# EAGLE design untitled2-6-2 (EAGLE 9.6.2)
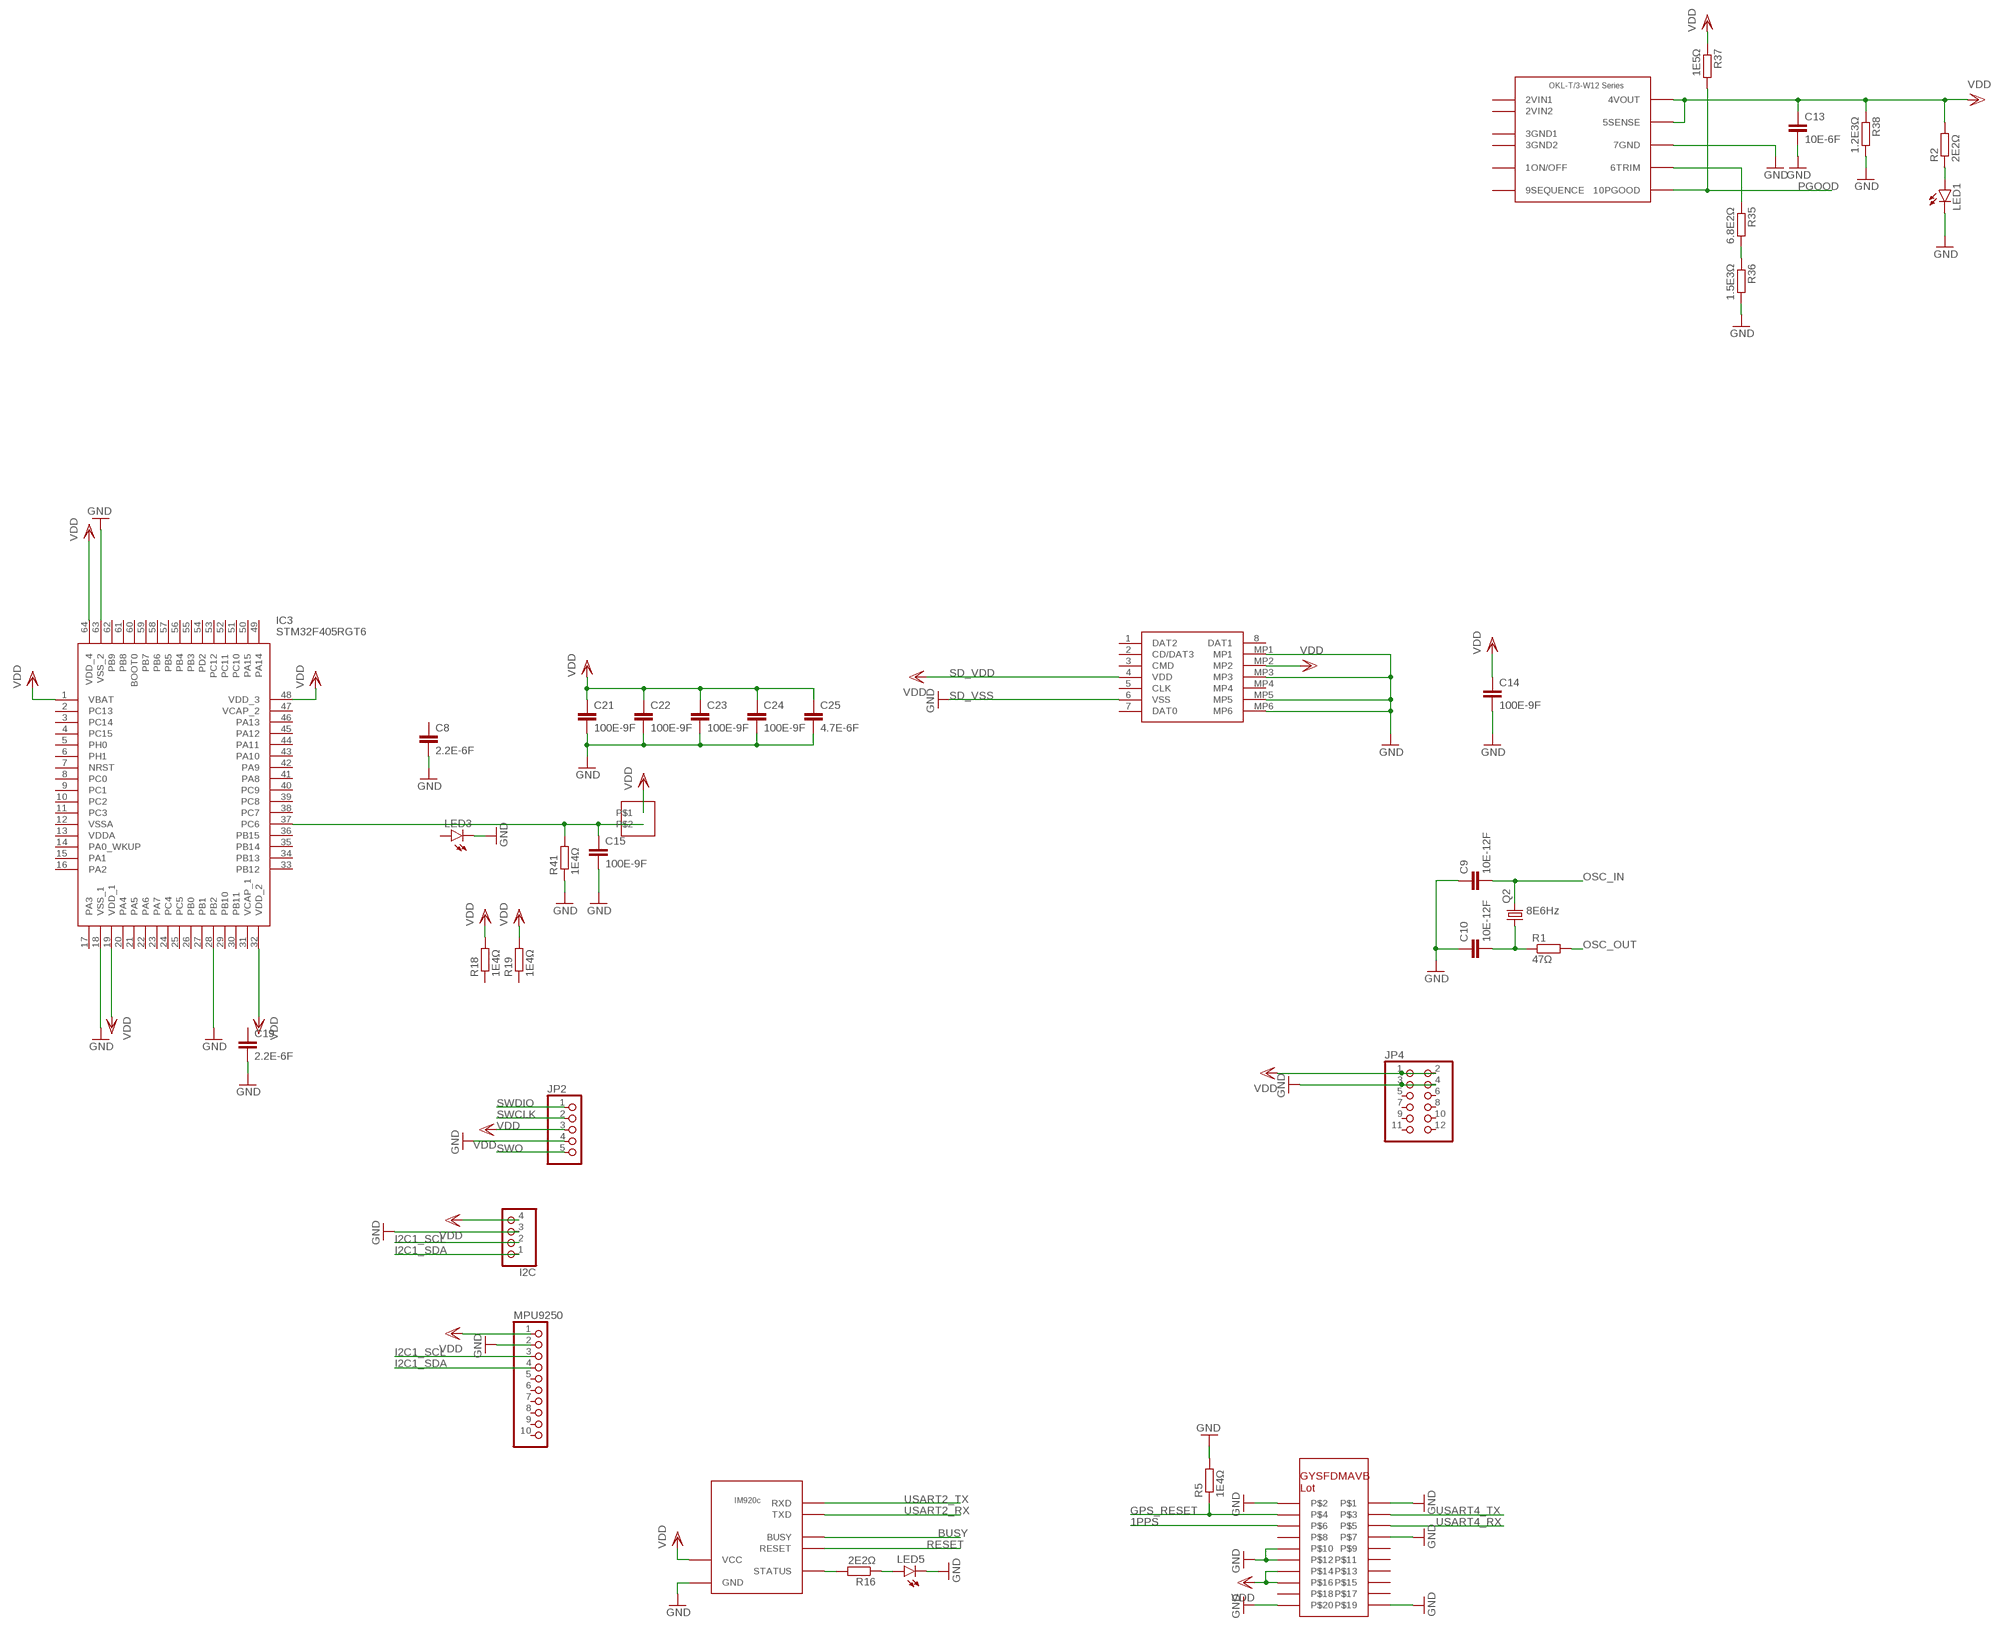
[diagram p0: schematic, sheet 1]

## Parts
C8  2.2E-6F  C-EUC0805  [C0805]
C9  10E-12F  C-EUC0805  [C0805]
C10  10E-12F  C-EUC0805  [C0805]
C13  10E-6F  C-EUC0805  [C0805]
C14  100E-9F  C-EUC0805  [C0805]
C15  100E-9F  C-EUC0805  [C0805]
C19  2.2E-6F  C-EUC0805  [C0805]
C21  100E-9F  C-EUC0805  [C0805]
C22  100E-9F  C-EUC0805  [C0805]
C23  100E-9F  C-EUC0805  [C0805]
C24  100E-9F  C-EUC0805  [C0805]
C25  4.7E-6F  C-EUC0805  [C0805]
I2C  PINHD-1X4  [1X04]
IC3  STM32F405RGT6  [QFP50P1200X1200X160-64N]
J1  DM3AT-SF-PEJM5  [DM3ATSFPEJM5]
JP2  PINHD-1X5  [1X05]
JP4  PINHD-2X6  [2X06]
LED1  LEDCHIP-LED0805  [CHIP-LED0805]
LED3  LEDCHIP-LED0805  [CHIP-LED0805]
LED5  LEDCHIP-LED0805  [CHIP-LED0805]
MPU9250  PINHD-1X10  [1X10]
Q2  CRYSTALCTS406  [CTS406]
R1  47Ω  R-EU_R0603  [R0603]
R2  2E2Ω  R-EU_R0603  [R0603]
R5  1E4Ω  R-EU_R0603  [R0603]
R16  2E2Ω  R-EU_R0603  [R0603]
R18  1E4Ω  R-EU_R0603  [R0603]
R19  1E4Ω  R-EU_R0603  [R0603]
R35  6.8E2Ω  R-EU_R0603  [R0603]
R36  1.5E3Ω  R-EU_R0603  [R0603]
R37  1E5Ω  R-EU_R0603  [R0603]
R38  1.2E3Ω  R-EU_R0603  [R0603]
R41  1E4Ω  R-EU_R0603  [R0603]
U$3  OKL-T/3-W12SERIES  [OKL-T/3-W12SERIES]
U$4  GYSFDMAXB_LOT  [GYSFDMAXB_LOT]
U$5  IM920C  [IM920C]
U$10  B2B-XH-A  [B2B-XH-A]

## Nets
1PPS: U$4.P$6
BUSY: U$5.BUSY
GND [VCC]: C8.2 C9.1 C10.1 C13.2 C14.2 C15.2 C19.2 C21.2 C22.2 C23.2 C24.2 C25.2 I2C.3 IC3.18(VSS_1) IC3.28(PB2) IC3.63(VSS_2) J1.6(VSS) J1.MP1 J1.MP3 J1.MP5 J1.MP6 JP2.4 JP4.3 JP4.4 LED1.C LED3.C LED5.C MPU9250.2 R5.2 R36.2 R38.2 R41.1 U$3.7GND U$4.P$1 U$4.P$2 U$4.P$7 U$4.P$10 U$4.P$12 U$4.P$19 U$4.P$20 U$5.GND
GPS_RESET: R5.1 U$4.P$4
I2C1_SCL: I2C.2 MPU9250.3
I2C1_SDA: I2C.1 MPU9250.4
N$1: R16.2 U$5.STATUS
N$2: LED1.A R2.1
N$5 [VCC]: C15.1 IC3.37(PC6) R41.2 U$10.P$2
N$7: C10.2 Q2.1 R1.1
N$27: R35.1 U$3.6TRIM
N$31: R35.2 R36.1
N$36: LED5.A R16.1
OSC_IN: C9.2 Q2.3
OSC_OUT: R1.2
PGOOD: R37.2 U$3.10PGOOD
RESET: U$5.RESET
SWCLK: JP2.2
SWDIO: JP2.1
SWO: JP2.5
USART2_RX: U$5.TXD
USART2_TX: U$5.RXD
USART4_RX: U$4.P$5
USART4_TX: U$4.P$3
VDD [VDD]: C13.1 C14.1 C21.1 C22.1 C23.1 C24.1 C25.1 I2C.4 IC3.1(VBAT) IC3.19(VDD_1) IC3.32(VDD_2) IC3.48(VDD_3) IC3.64(VDD_4) J1.4(VDD) J1.MP2 JP2.3 JP4.1 JP4.2 MPU9250.1 R2.2 R18.2 R19.2 R37.1 R38.1 U$3.4VOUT U$3.5SENSE U$4.P$14 U$4.P$16 U$5.VCC U$10.P$1
Unconnected: C8.1 C19.1 IC3.2(PC13) IC3.3(PC14) IC3.4(PC15) IC3.5(PH0) IC3.6(PH1) IC3.7(NRST) IC3.8(PC0) IC3.9(PC1) IC3.10(PC2) IC3.11(PC3) IC3.12(VSSA) IC3.13(VDDA) IC3.14(PA0_WKUP) IC3.15(PA1) IC3.16(PA2) IC3.17(PA3) IC3.20(PA4) IC3.21(PA5) IC3.22(PA6) IC3.23(PA7) IC3.24(PC4) IC3.25(PC5) IC3.26(PB0) IC3.27(PB1) IC3.29(PB10) IC3.30(PB11) IC3.31(VCAP_1) IC3.33(PB12) IC3.34(PB13) IC3.35(PB14) IC3.36(PB15) IC3.38(PC7) IC3.39(PC8) IC3.40(PC9) IC3.41(PA8) IC3.42(PA9) IC3.43(PA10) IC3.44(PA11) IC3.45(PA12) IC3.46(PA13) IC3.47(VCAP_2) IC3.49(PA14) IC3.50(PA15) IC3.51(PC10) IC3.52(PC11) IC3.53(PC12) IC3.54(PD2) IC3.55(PB3) IC3.56(PB4) IC3.57(PB5) IC3.58(PB6) IC3.59(PB7) IC3.60(BOOT0) IC3.61(PB8) IC3.62(PB9) J1.1(DAT2) J1.2(CD/DAT3) J1.3(CMD) J1.5(CLK) J1.7(DAT0) J1.8(DAT1) J1.MP4 JP4.5 JP4.6 JP4.7 JP4.8 JP4.9 JP4.10 JP4.11 JP4.12 LED3.A MPU9250.5 MPU9250.6 MPU9250.7 MPU9250.8 MPU9250.9 MPU9250.10 R18.1 R19.1 U$3.1ON/OFF U$3.2VIN1 U$3.2VIN2 U$3.3GND1 U$3.3TGND2(3GND2) U$3.9SEQUENCE U$4.P$8 U$4.P$9 U$4.P$11 U$4.P$13 U$4.P$15 U$4.P$17 U$4.P$18

## Notes on the sheet
- SD_VDD
- SD_VSS
- 8E6Hz

## Library data of the parts
C8-C10 C13-C15 C19 C21-C25 = rcl:C-EU: CAPACITOR, European symbol; SPICEPREFIX: C
I2C = pinhead:PINHD-1X4: PIN HEADER
IC3 = SamacSys_Parts:STM32F405RGT6: MCU 32-Bit, ARM Cortex M4, 1MB Flash STMicroelectronics STM32F405RGT6, 32bit ARM Cortex M4F Microcontroller, 168MHz, 1024 kB Flash, 64-Pin LQFP Source: Datasheet <http://www.st.com/web/en/resource/technical/document/datasheet/DM00037051.pdf>; DESCRIPTION: MCU 32-Bit, ARM Cortex M4, 1MB Flash STMicroelectronics STM32F405RGT6, 32bit ARM Cortex M4F Microcontroller, 168MHz, 1024 kB Flash, 64-Pin LQFP; HEIGHT: 1.6mm; MANUFACTURER_NAME: STMicroelectronics; MANUFACTURER_PART_NUMBER: STM32F405RGT6; MOUSER_PART_NUMBER: 511-STM32F405RGT6; MOUSER_PRICE-STOCK: https://www.mouser.co.uk/ProductDetail/STMicroelectronics/STM32F405RGT6?qs=Z8%252BeY1k3TIKgj7QWsYGpQw%3D%3D
J1 = SamacSys_Parts:DM3AT-SF-PEJM5: Memory Card Connectors R/A SMT MICROSD CON PUSH-PUSH TOP BRDMNT Source: Datasheet <https://datasheet.lcsc.com/szlcsc/Hirose-HRS-DM3AT-SF-PEJM5_C114218.pdf>; DESCRIPTION: Memory Card Connectors R/A SMT MICROSD CON PUSH-PUSH TOP BRDMNT; HEIGHT: 1.83mm; MANUFACTURER_NAME: Hirose; MANUFACTURER_PART_NUMBER: DM3AT-SF-PEJM5; MOUSER_PART_NUMBER: 798-DM3AT-SF-PEJM5; MOUSER_PRICE-STOCK: https://www.mouser.co.uk/ProductDetail/Hirose-Connector/DM3AT-SF-PEJM5/?qs=LZSZKJVF%252B2WTDKp%252BR7IYAQ%3D%3D
JP2 = pinhead:PINHD-1X5: PIN HEADER
JP4 = pinhead:PINHD-2X6: PIN HEADER
LED1 LED3 LED5 = led:LED: LED OSRAM: - CHIPLED LG R971, LG N971, LY N971, LG Q971, LY Q971, LO R971, LY R971 LH N974, LH R974 LS Q976, LO Q976, LY Q976 LO Q996 - Hyper CHIPLED LW Q18S LB Q993, LB Q99A, LB R99A - SideLED LS A670, LO A670, LY A670, LG A670, LP A670 LB A673, LV A673, LT A673, LW A673 LH A674 LY A675 LS A676, LA A676, LO A676, LY A676, LW A676 LS A679, LY A679, LG A679 - Hyper Micro SIDELED® LS Y876, LA Y876, LO Y876, LY Y876 LT Y87S - SmartLED LW L88C, LW L88S LB L89C, LB L89S, LG L890 LS L89K, LO L89K, LY L89K LS L896, LA L896, LO L896, LY L896 - TOPLED LS T670, LO T670, LY T670, LG T670, LP T670 LSG T670, LSP T670, LSY T670, LOP T670, LYG T670 LG T671, LOG T671, LSG T671 LB T673, LV T673, LT T673, LW T673 LH T674 LS T676, LA T676, LO T676, LY T676, LB T676, LH T676, LSB T676, LW T676 LB T67C, LV T67C, LT T67C, LS T67K, LO T67K, LY T67K, LW E67C LS E67B, LA E67B, LO E67B, LY E67B, LB E67C, LV E67C, LT E67C LW T67C LS T679, LY T679, LG T679 LS T770, LO T770, LY T770, LG T770, LP T770 LB T773, LV T773, LT T773, LW T773 LH T774 LS E675, LA E675, LY E675, LS T675 LS T776, LA T776, LO T776, LY T776, LB T776 LHGB T686 LT T68C, LB T68C - Hyper Mini TOPLED® LB M676 - Mini TOPLED Santana® LG M470 LS M47K, LO M47K, LY M47K Source: http://www.osram.convergy.de LUXEON: - LUMILED® LXK2-PW12-R00, LXK2-PW12-S00, LXK2-PW14-U00, LXK2-PW14-V00 LXK2-PM12-R00, LXK2-PM12-S00, LXK2-PM14-U00 LXK2-PE12-Q00, LXK2-PE12-R00, LXK2-PE12-S00, LXK2-PE14-T00, LXK2-PE14-U00 LXK2-PB12-K00, LXK2-PB12-L00, LXK2-PB12-M00, LXK2-PB14-N00, LXK2-PB14-P00, LXK2-PB14-Q00 LXK2-PR12-L00, LXK2-PR12-M00, LXK2-PR14-Q00, LXK2-PR14-R00 LXK2-PD12-Q00, LXK2-PD12-R00, LXK2-PD12-S00 LXK2-PH12-R00, LXK2-PH12-S00 LXK2-PL12-P00, LXK2-PL12-Q00, LXK2-PL12-R00 Source: www.luxeon.com KINGBRIGHT: KA-3528ASYC Source: www.kingbright.com
MPU9250 = pinhead:PINHD-1X10: PIN HEADER
Q2 = crystal:CRYSTAL: CRYSTAL; OC_FARNELL: unknown; OC_NEWARK: unknown
R1 R2 R5 R16 R18 R19 R35-R38 R41 = rcl:R-EU_: RESISTOR, European symbol; SPICEPREFIX: R
U$3 = untitled:OKL-T/3-W12SERIES
U$4 = untitled:GYSFDMAXB_LOT
U$5 = untitled:IM920C
U$10 = untitled:B2B-XH-A

## Net classes
1 supply: width 0.15 mm
2 VDD: width 0.254 mm
3 VCC: width 0.305 mm
4 VIN: width 0.61 mm

## Board
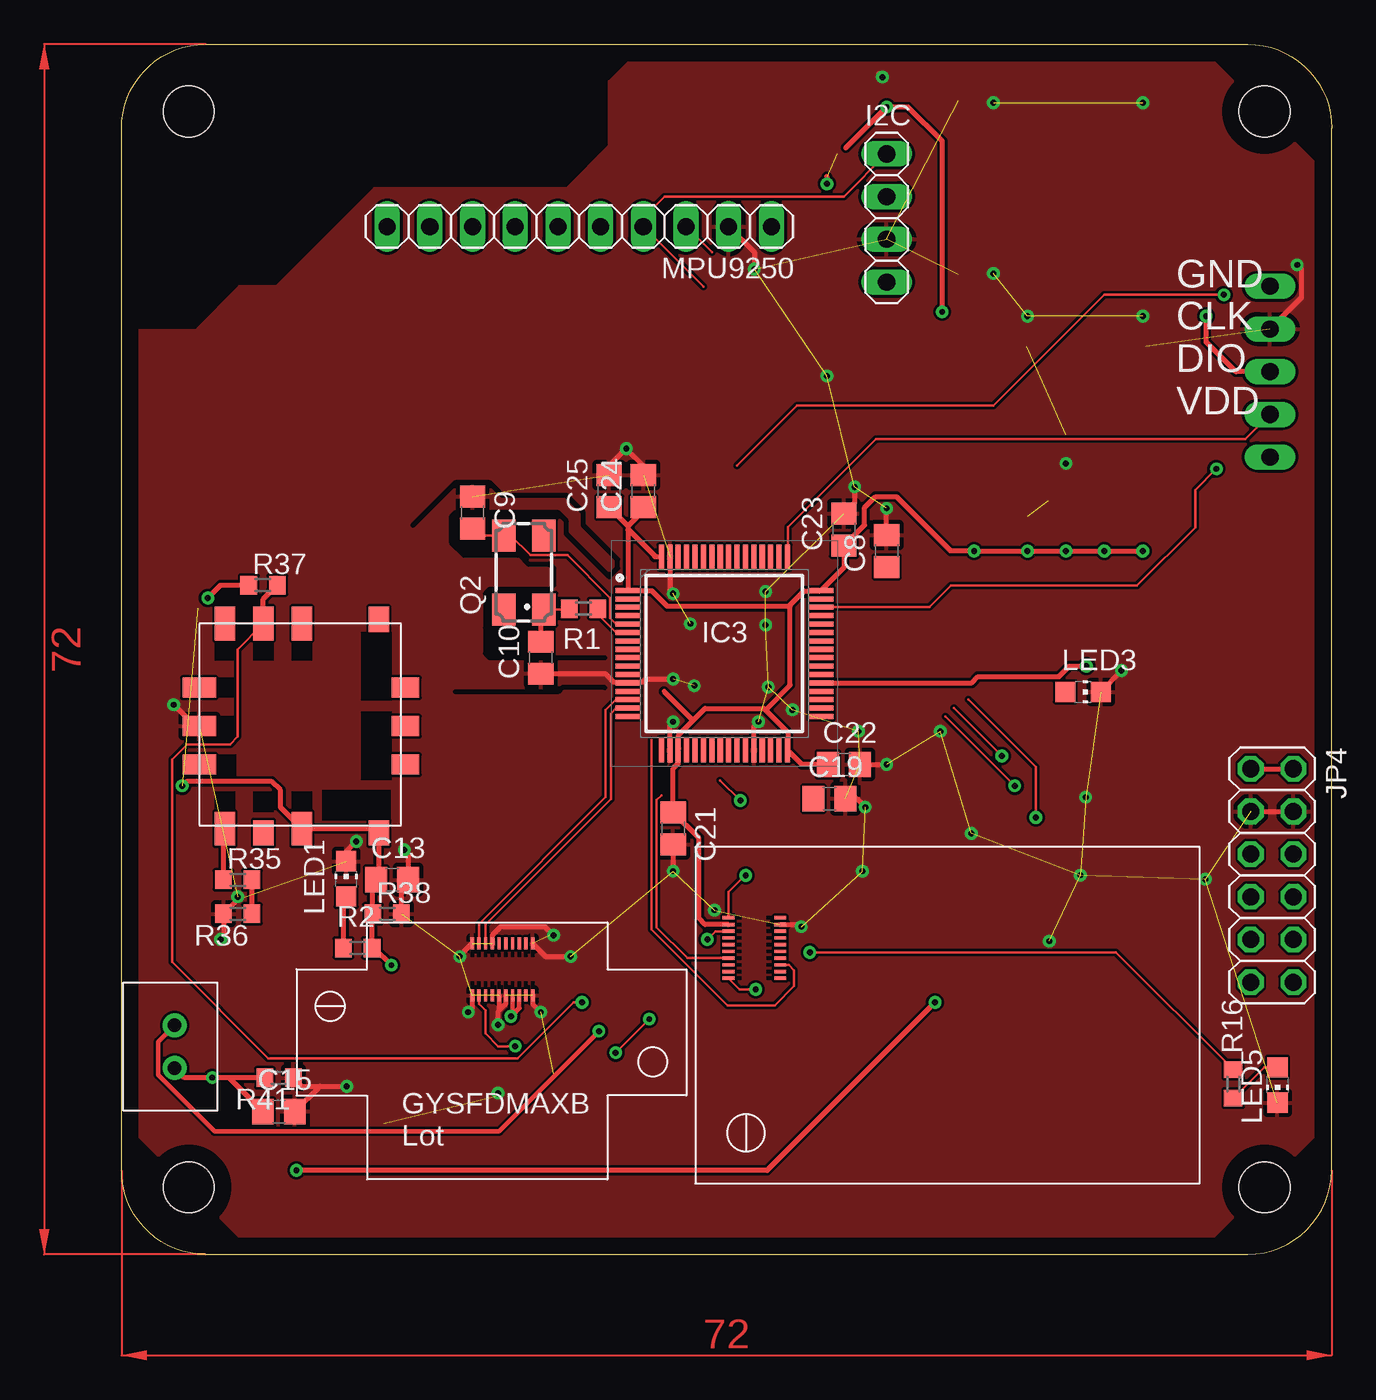
[diagram p1: board, top side]
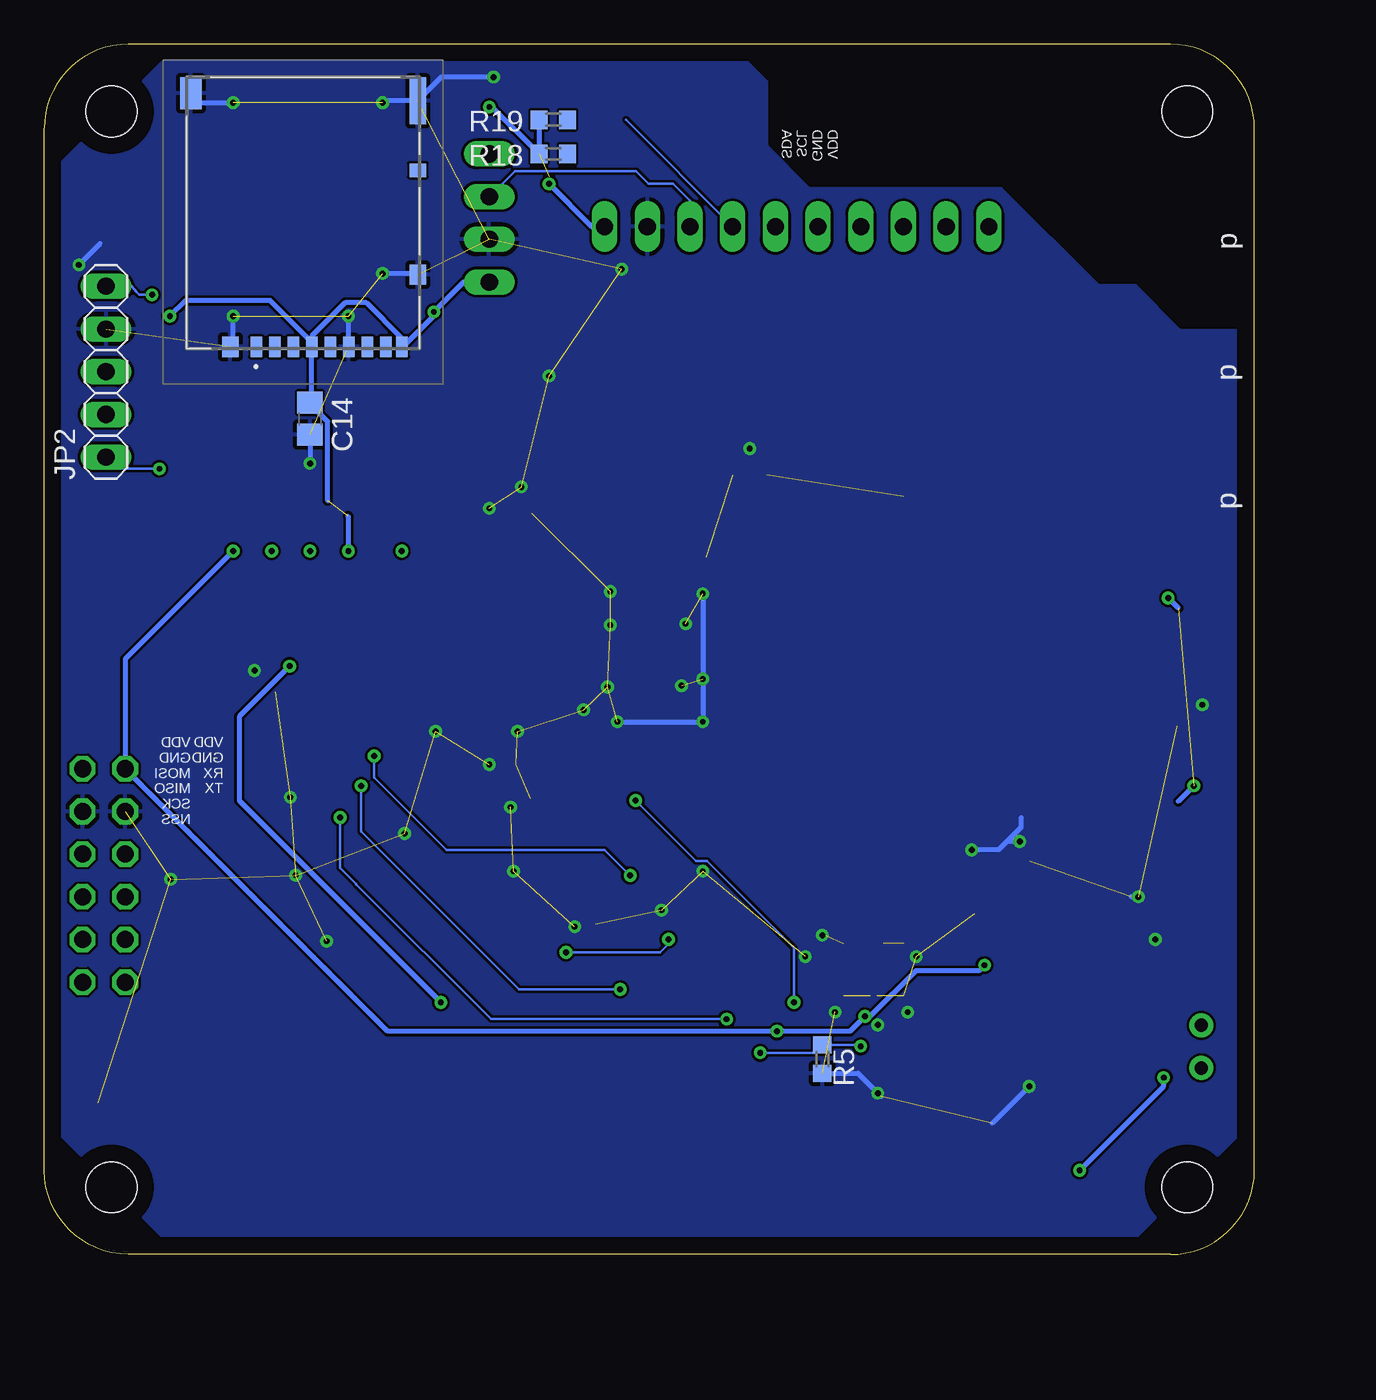
[diagram p2: board, bottom side, seen from below]

Size 72 x 72 mm. Coordinates in mm from the lower left corner, seen from the top.
Outline: 5,0 67,0 arc89 72,5 72,67 arc90 67,72 5,72 arc90 0,67 0,5 arc90 5,0
Copper layers (1*16): Top 0.035mm / dielectric 1.5mm / Bottom 0.035mm
Design rules "default": minimum track width 6mil, minimum drill 0.35mm, track to track 6mil, track to pad 6mil, pad to pad 6mil, via to via 6mil, smd to smd 6mil, copper to edge 40mil, drill to drill 6mil, minimum pad ring 10mil, minimum via ring 8mil, stop-mask expansion 4mil, vias tented up to drill 0mil, thermal gap 10mil
Holes 3 mm at 68,68 68,4 4,4 4,68
tRestrict: 36 lines

### Footprints (pad centres in the part's own frame; a part is rotated, then mirrored left to right if it is on the bottom)
C0805 = smd 1.3 x 1.5: 1 -0.95,0; 2 0.95,0
1X04 = drill 1.016 long: 1 -3.81,0; 2 -1.27,0; 3 1.27,0; 4 3.81,0
QFP50P1200X1200X160-64N = smd 1.475 x 0.3: 1 -5.738,3.75; 2 -5.738,3.25; 3 -5.738,2.75; 4 -5.738,2.25; 5 -5.738,1.75; 6 -5.738,1.25; 7 -5.738,0.75; 8 -5.738,0.25; 9 -5.738,-0.25; 10 -5.738,-0.75; 11 -5.738,-1.25; 12 -5.738,-1.75; 13 -5.738,-2.25; 14 -5.738,-2.75; 15 -5.738,-3.25; 16 -5.738,-3.75; 33 5.738,-3.75; 34 5.738,-3.25; 35 5.738,-2.75; 36 5.738,-2.25; 37 5.738,-1.75; 38 5.738,-1.25; 39 5.738,-0.75; 40 5.738,-0.25; 41 5.738,0.25; 42 5.738,0.75; 43 5.738,1.25; 44 5.738,1.75; 45 5.738,2.25; 46 5.738,2.75; 47 5.738,3.25; 48 5.738,3.75 | smd 0.3 x 1.475: 17 -3.75,-5.738; 18 -3.25,-5.738; 19 -2.75,-5.738; 20 -2.25,-5.738; 21 -1.75,-5.738; 22 -1.25,-5.738; 23 -0.75,-5.738; 24 -0.25,-5.738; 25 0.25,-5.738; 26 0.75,-5.738; 27 1.25,-5.738; 28 1.75,-5.738; 29 2.25,-5.738; 30 2.75,-5.738; 31 3.25,-5.738; 32 3.75,-5.738; 49 3.75,5.738; 50 3.25,5.738; 51 2.75,5.738; 52 2.25,5.738; 53 1.75,5.738; 54 1.25,5.738; 55 0.75,5.738; 56 0.25,5.738; 57 -0.25,5.738; 58 -0.75,5.738; 59 -1.25,5.738; 60 -1.75,5.738; 61 -2.25,5.738; 62 -2.75,5.738; 63 -3.25,5.738; 64 -3.75,5.738
DM3ATSFPEJM5 = smd 0.7 x 1.2: 1 2.775,7.412; 2 1.675,7.412; 3 0.575,7.412; 4 -0.525,7.412; 5 -1.625,7.412; 6 -2.725,7.412; 7 -3.825,7.412; 8 -4.925,7.412; MP2 -5.875,7.412 | smd 1 x 1.2: MP1 4.325,7.412; MP3 -6.825,3.112 | smd 1 x 0.8: MP4 -6.825,-3.087 | smd 1 x 2.8: MP5 -6.825,-7.237 | smd 1.3 x 1.9: MP6 6.675,-7.688
1X05 = drill 1.016 long: 1 -5.08,0; 2 -2.54,0; 3 0,0; 4 2.54,0; 5 5.08,0
2X06 = drill 1.016 octagon: 1 -6.35,-1.27; 2 -6.35,1.27; 3 -3.81,-1.27; 4 -3.81,1.27; 5 -1.27,-1.27; 6 -1.27,1.27; 7 1.27,-1.27; 8 1.27,1.27; 9 3.81,-1.27; 10 3.81,1.27; 11 6.35,-1.27; 12 6.35,1.27
CHIP-LED0805 = smd 1.2 x 1.2: A 0,-1.05; C 0,1.05
1X10 = drill 1.016 long: 1 -11.43,0; 2 -8.89,0; 3 -6.35,0; 4 -3.81,0; 5 -1.27,0; 6 1.27,0; 7 3.81,0; 8 6.35,0; 9 8.89,0; 10 11.43,0
CTS406 = smd 1.9 x 1.4: 1 -2.2,-1.2; 2 2.2,-1.2; 3 2.2,1.2; 4 -2.2,1.2
R0603 = smd 1 x 1.1: 1 -0.85,0; 2 0.85,0
OKL-T/3-W12SERIES = smd 2 x 1.2: 1ON/OFF 0,6.1; 5SENSE 12.2,6.1; 6TRIM 12.2,1.52; 9SEQUENCE 0,1.52; 10PGOOD 0,3.81 | smd 1.5 x 1.2: 2VIN1 -0.25,10.68; 4VOUT 12.45,10.68; P$10 12.45,3.81 | smd 1.2 x 1.63: 2VIN2 3.81,12.27; 3GND1 6.1,12.27; 3TGND2 8.39,12.27 | smd 1.2 x 2: 7GND 6.1,0; P$6 3.81,0; P$8 8.39,0
GYSFDMAXB_LOT = smd 0.2 x 0.7: P$1 -1.8,1.54; P$2 -1.8,-1.54; P$3 -1.4,1.54; P$4 -1.4,-1.54; P$5 -1,1.54; P$6 -1,-1.54; P$7 -0.6,1.54; P$8 -0.6,-1.54; P$9 -0.2,1.54; P$10 -0.2,-1.54; P$11 0.2,1.54; P$12 0.2,-1.54; P$13 0.6,1.54; P$14 0.6,-1.54; P$15 1,1.54; P$16 1,-1.54; P$17 1.4,1.54; P$18 1.4,-1.54; P$19 1.8,1.54; P$20 1.8,-1.54
IM920C = smd 0.2 x 0.7: BUSY -1.8,1.54; GND 1.4,-1.54; P$2 -1.8,-1.54; P$3 -1.4,1.54; P$4 -1.4,-1.54; P$5 -1,1.54; P$8 -0.6,-1.54; P$9 -0.2,1.54; P$10 -0.2,-1.54; P$11 0.2,1.54; P$12 0.2,-1.54; P$13 0.6,1.54; P$14 0.6,-1.54; P$20 1.8,-1.54; REG 1,-1.54; RESET 1.8,1.54; RXD -1,-1.54; STATUS 1,1.54; TXD -0.6,1.54; VCC 1.4,1.54
B2B-XH-A = drill 0.8 pad 1.422: P$1 0,0; P$2 2.54,0

### Placement (x,y rotation side)
C8  45.52,41.85 90 top
C9  20.88,44.14 270 top
C10  24.95,35.5 90 top
C13  16.11,22.29 0 top
C14  56.19,49.72 270 bottom
C15  9.36,8.5 0 top
C19  42.12,27.12 0 top
C21  32.82,25.34 270 top
C22  42.98,29.15 0 top
C23  42.98,43.12 90 top
C24  31.04,45.41 90 top
C25  29.01,45.41 90 top
I2C  45.52,61.66 270 top
IC3  35.87,35.75 0 top
J1  56.6,61.41 180 bottom
JP2  68.33,52.52 90 bottom
JP4  68.45,22.55 270 top
LED1  13.36,22.34 0 top
LED3  57.2,33.47 270 top
LED5  68.77,10.08 180 top
MPU9250  27.23,61.15 180 top
Q2  23.93,40.58 90 top
R1  27.49,38.42 0 top
R2  14.05,18.23 0 top
R5  25.71,11.62 270 bottom
R16  66.14,10.15 90 top
R18  41.71,65.47 180 bottom
R19  41.71,67.5 180 bottom
R35  6.91,22.29 0 top
R36  6.91,20.26 180 top
R37  8.42,39.82 0 top
R38  15.8,20.26 0 top
R41  9.37,10.52 180 top
U$3  4.63,37.53 270 top
U$4  22.66,16.96 0 top
U$5  37.65,18.23 90 top
U$10  3.16,13.64 270 top

### Tracks (layer width: path | path; a pad name or v marks a point on that pad's centre or on a via)
BUSY  (via drill 0.35)
  Top 0.152: v53.14,27.88 49.02,32 | v37.73,15.77 36.76,15.77 U$5.BUSY
  Bottom 0.152: v53.14,27.88 53.14,25.15 43.76,15.77 v37.73,15.77
GND  (via drill 0.35)  (47 unrouted)
  Top 0.305: IC3.18 32.62,31.49 v32.82,31.69 | v32.82,34.23 31.17,34.23 30.99,34.05 30.17,34.05 29.27,34.05 28.77,34.55 C10.1 | IC3.28 37.62,31.41 v37.9,31.69 | IC3.63 32.62,39.51 v32.82,39.31 | C22.2 v45.52,29.15 | C19.2 43.74,27.12 v44.25,26.61 | C25.2 29.01,46.93 v30.03,47.95 31.04,46.93 C24.2 | C21.2 v32.82,22.8 | v43.62,45.66 43.62,44.7 C23.2 | C8.2 v45.52,44.39 | LED3.C 59.49,34.7 v59.49,34.74 | v69.94,58.87 70.19,58.61 70.19,56.92 JP2.4 | 25.49,18.99 v25.71,18.99 25.2,19.5 22.55,19.5 22.06,19.01 U$4.P$7 | v40.44,19.5 40.31,19.63 U$5.GND | R38.2 16.65,21.89 C13.2 17.06,23.83 v16.82,24.07 | LED1.C 13.36,23.97 v13.96,24.57 | JP4.3 JP4.4 | U$3.7GND 4.38,31.43 v3.1,32.71 | 45.05,70.26 v45.27,70.04 | MPU9250.2 37.65,59.63 v37.65,58.61 | 22.46,14.51 22.41,14.46 v22.41,13.66 | v20.12,17.72 20.12,17.76 U$4.P$1 | v5.9,18.74 6.06,18.9 R36.2 6.91,21.11 v6.91,21.28 | U$4.P$19 25.24,17.72 v26.72,17.72 | U$4.P$10 22.46,14.51 | U$4.P$12 22.86,14.91 22.46,14.51 | U$4.P$20 24.46,14.9 v24.95,14.42 | U$4.P$2 20.86,14.65 v20.63,14.42 | R41.1 10.74,10 v13.4,10 11.81,10 C15.2
  Bottom 0.305: v37.9,31.69 v32.82,31.69 v32.82,34.23 v32.82,39.31 | C14.2 v56.19,47.06 | J1.6 53.87,55.79 v53.9,55.82 | J1.MP3 49.84,58.36 v51.87,58.36 | v51.87,68.52 51.74,68.64 J1.MP5 48.38,70.04 v45.27,70.04 | J1.MP6 62.7,68.52 v60.76,68.52 | J1.MP1 60.76,54.16 v60.76,55.82 | v69.94,58.87 68.67,60.14 | 13.89,25.98 13.89,25.4 14.73,24.57 | 14.73,24.57 15.23,24.07 v16.82,24.07 | v13.96,24.57 14.73,24.57 | R5.2 23.59,10.77 v22.41,9.59 22.22,9.4 | 7.33,21.28 v6.91,21.28 | v13.4,10 15.59,7.81
  other vias: 41.96,52.26 35.28,20.48 55.2,18.64 44.08,22.8 57.04,22.56 64.48,22.32 50.56,25.04 57.36,27.2 48.72,31.12 43.84,31.12 33.84,37.52 38.32,37.44 38.48,33.76 34.08,33.84 38.32,39.44 39.92,32.4
  pour Top: -0.2,55.02 4.4,55 7,57.6 9.2,57.6 15.04,63.44 26.47,63.44 29.01,65.98 29.01,69.79 31.55,72.33 63.65,72.33 72.19,63.79 72.19,8.21 63.92,-0.06 8.08,-0.06 -0.2,8.22
  pour Bottom: -0.21,8.22 -0.25,55 4.4,55 7.06,57.66 9.26,57.66 15.04,63.44 26.47,63.44 29.01,65.98 29.01,69.79 31.55,72.33 63.65,72.33 72.19,63.79 72.19,8.22 63.91,-0.06 8.07,-0.06
GPS_RESET  (via drill 0.35)
  Top 0.152: U$4.P$4 21.26,14.91 21.64,14.53 21.64,13.15 22.41,12.39 v23.42,12.39 | 50.4,33 54.4,29 v54.4,26 | v31.4,14 v29.4,12
  Bottom 0.152: v23.42,12.39 23.51,12.47 R5.1 26.18,12 v29.4,12 | v54.4,26 54.4,23 53.45,22.05 53.45,22.03 45.42,14 v31.4,14
I2C1_SCL
  Top 0.152: 35.12,59.62 MPU9250.3
  Bottom 0.152: MPU9250.3 33.58,62.68 34.6,63.69 36.03,63.69 36.8,64.46 39.84,64.46 44,64.46 I2C.2
I2C1_SDA
  Top 0.152: 34.62,57.58 MPU9250.4 31.04,61.66 32.31,62.93 42.98,62.93 I2C.1
  Bottom 0.152: MPU9250.4 37.39,67.5
N$1  (via drill 0.35)
  Top 0.152: R16.2 59.16,17.97 v40.95,17.97 | U$5.STATUS 35.34,19.23 v34.85,18.74
  Bottom 0.152: v40.95,17.97 35.36,17.97 34.85,18.48 v34.85,18.74
N$2
  Top 0.305: 13.31,21.24 LED1.A 13.2,21.13 R2.1
N$5  (via drill 0.35)
  Top 0.305: R41.2 6.39,10.52 | U$10.P$2 3.74,10.52 v5.4,10.52 6.39,10.52 | C15.1 6.39,10.52 | v57.4,35 56.4,35 55.77,34.37 50.95,34.37 50.58,34 IC3.37 | v48.4,15 38.4,5 v10.4,5
  Bottom 0.305: v57.4,35 60.4,32 60.4,27 v48.4,15 | v10.4,5 5.4,10 v5.4,10.52
N$7
  Top 0.152: R1.1 26.59,38.38 25.2,38.38 Q2.1
  Top 0.305: C10.2 24.95,38.13 25.2,38.38
N$27
  Top 0.305: R35.1 6.06,25.25 U$3.6TRIM
N$31
  Top 0.305: R36.1 R35.2
N$36
  Top 0.152: LED5.A 67.98,11.13 R16.1
OSC_IN
  Top 0.152: 29.42,37.5 29.06,37.86 29.06,39.07 26.53,41.6 24.34,41.6 23.16,42.78 Q2.3 21.29,42.78 C9.2
OSC_OUT
  Top 0.152: R1.2 28.35,38.41 28.35,38.07 29.42,37
PGOOD  (via drill 0.35)
  Top 0.152: 35.62,28.21 v36.81,27.01 | v27.4,15 26.89,15 23.57,11.68 8.72,11.68 3,17.4 3,29.44 3.91,30.35 6.45,30.35 6.9,30.8 6.9,36 U$3.10PGOOD
  Top 0.305: U$3.10PGOOD 8.44,38.98 R37.2
  Bottom 0.152: v36.81,27.01 33.21,23.41 32.57,23.41 27.4,18.24 v27.4,15
RESET  (via drill 0.35)
  Top 0.152: 49.53,32.5 v52.38,29.66 | U$5.RESET 36.11,21.55 37.1,22.55 v37.14,22.55
  Bottom 0.152: v37.14,22.55 38.66,24.07 48.06,24.07 52.38,28.39 v52.38,29.66
SWCLK
  Top 0.152: 39.65,41.53 39.65,43.28 44.88,48.52 66.87,48.52 JP2.2
SWDIO  (via drill 0.35)
  Top 0.152: 41.71,38.52 48.06,38.52 49.33,39.79 60.41,39.79 63.87,43.25 63.87,45.47 v65.14,46.74
  Bottom 0.152: JP2.1 67.63,46.74 v65.14,46.74
SWO  (via drill 0.35)
  Top 0.152: 36.62,46.92 40.19,50.49 51.87,50.49 58.47,57.09 v65.59,57.09
  Bottom 0.152: JP2.5 66.79,57.6 66.5,57.24 66.35,57.09 v65.59,57.09
USART2_RX
  Top 0.152: 32.12,27.31 31.84,27.03 31.84,19.46 33.67,17.63 U$5.TXD
USART2_TX
  Top 0.152: U$5.RXD 39.69,17.23 40.02,16.9 40.02,15.98 38.87,14.83 36.04,14.83 31.54,19.33 31.54,30.6
USART4_RX
  Top 0.152: 29.42,32.5 29.11,32.2 29.11,27.09 21.66,19.63 U$4.P$5
USART4_TX
  Top 0.152: 29.42,33 28.81,32.39 28.81,27.21 21.26,19.66 U$4.P$3
VDD  (via drill 0.35)  (3 unrouted)
  Top 0.254: U$4.P$14 23.26,14.26 | U$4.P$16 23.66,14.66 | v28.4,13.28 22.45,7.33 5.53,7.33 2.17,10.69 2.17,12.65 U$10.P$1
  Top 0.305: 29.01,44.2 C25.1 30.13,43.34 | C22.1 40.48,29.15 IC3.32 39.65,30.1 39.65,31.05 38.3,32.4 | v60.76,41.85 v58.47,41.85 v56.19,41.85 v53.9,41.85 v50.73,41.85 49.33,41.85 46.11,45.07 44.86,45.07 44.2,44.42 44.2,43.39 C23.1 42.98,40.88 IC3.48 41.55,39.47 40.6,39.47 39.77,38.64 39.77,38.55 | 38.3,32.4 38.22,32.48 34.73,32.48 34.01,31.77 | 34.01,31.77 33.14,30.9 33.14,30.1 IC3.19 33.12,29.2 32.82,28.9 C21.1 34.34,24.77 34.34,20.01 34.72,19.63 U$5.VCC | 39.77,38.55 39.77,33.88 38.3,32.4 | 39.77,38.55 32.47,38.55 31.55,39.47 30.28,39.47 IC3.1 30.13,43.12 | 32.28,33.5 34.01,31.77 | IC3.64 31.8,41.49 | 31.8,41.49 31.72,41.49 | v48.82,56.07 48.82,66.23 46.79,68.27 v45.52,68.27 43.09,65.84 | 14.9,20.31 14.9,22.03 C13.1 15.31,22.44 U$3.4VOUT 15.06,25.33 U$3.5SENSE 9.45,26.61 9.45,27.63 8.94,28.13 3.86,28.13 v3.61,27.88 | 14.9,20.31 R38.1 | 14.9,20.31 R2.2 15.04,18.23 v16.06,17.21 | JP4.1 JP4.2 | 41.96,64.13 v41.96,63.69 | v23.17,14.16 23.26,14.26 23.66,14.66 | JP2.3 66.3,52.52 64.52,54.3 v64.52,55.82 | v5.13,39.06 5.9,39.82 R37.1 | 30.13,43.34 30.13,43.12 | 30.13,43.34 31.04,44.25 C24.1 | 31.8,41.49 30.18,43.12 30.13,43.12
  Bottom 0.305: 56.16,50.58 C14.1 56.07,50.79 | 50.76,54.55 50.76,54.07 50.73,54.04 J1.MP2 | 50.76,54.55 52.82,56.61 54.09,56.61 56.07,54.63 J1.4 | 50.76,54.55 50.43,54.22 48.82,55.82 v48.82,56.07 47.04,57.85 I2C.4 | R19.2 R18.2 45.35,68.27 v45.52,68.27 | 56.07,50.79 J1.4 | v41.96,63.69 39.42,61.15 MPU9250.1 | 56.07,50.79 56.07,50.49 55.13,49.55 55.13,44.85 | v53.9,41.85 53.9,43.88 53.93,43.91 | J1.4 56.07,54.28 58.55,56.76 63.58,56.76 v64.52,55.82 | v60.76,41.85 67.18,35.43 JP4.1 51.56,13.28 v28.4,13.28 24.05,13.28 v23.17,14.16 22.86,14.16 20.15,16.88 16.39,16.88 v16.06,17.21 | 4.54,38.46 v5.13,39.06 | v3.61,27.88 4.54,26.95
(copper drawn outside any net)
  shapes: Top area x3

### Text on the board
tPlace: GND / CLK / DIO / VDD
bNames: VDD / GND / SCL / SDA | p | p | p | VDD / GND / RX / TX | VDD / GND / MOSI / MISO / SCK / NSS
tDocu: +
bDocu: +